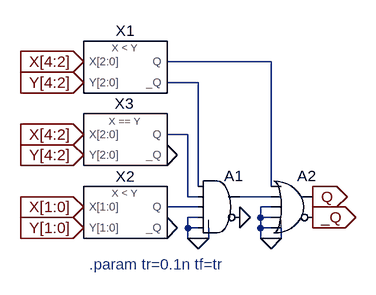
[diagram p0: schematic lt-5bit.asc]
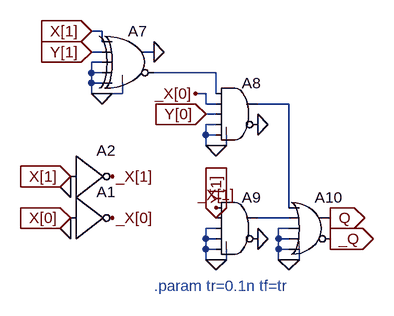
[diagram p1: sub-circuit lt-2bit.asc]
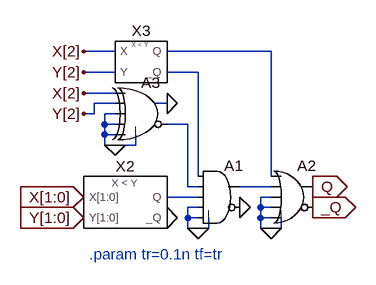
[diagram p2: sub-circuit lt-3bit.asc]
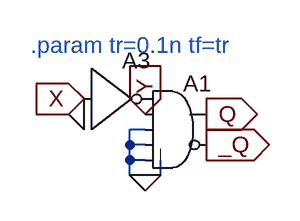
[diagram p3: sub-circuit lt.asc]
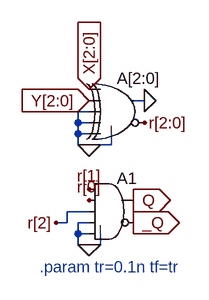
[diagram p4: sub-circuit eq-3bit.asc]
lt-5bit.asc, the LTspice schematic file:
Version 4
SHEET 1 880 680
WIRE 304 64 144 64
WIRE 192 96 144 96
WIRE 176 176 144 176
WIRE 192 256 192 96
WIRE 304 256 304 64
WIRE 176 272 176 176
WIRE 192 272 176 272
WIRE 304 272 256 272
WIRE 192 288 144 288
WIRE 304 288 288 288
WIRE 192 304 176 304
WIRE 288 304 288 288
WIRE 304 304 288 304
WIRE 176 320 176 304
WIRE 192 320 176 320
WIRE 288 320 288 304
WIRE 304 320 288 320
WIRE 176 336 176 320
WIRE 192 336 176 336
WIRE 208 336 208 320
WIRE 208 336 192 336
WIRE 288 336 288 320
WIRE 304 336 288 336
WIRE 320 336 320 320
WIRE 320 336 304 336
FLAG 16 64 X[4:2]
IOPIN 16 64 In
FLAG 16 288 X[1:0]
IOPIN 16 288 In
FLAG 16 176 X[4:2]
IOPIN 16 176 In
FLAG 16 96 Y[4:2]
IOPIN 16 96 In
FLAG 16 208 Y[4:2]
IOPIN 16 208 In
FLAG 16 320 Y[1:0]
IOPIN 16 320 In
FLAG 192 336 0
FLAG 256 304 0
FLAG 304 336 0
FLAG 368 272 Q
IOPIN 368 272 Out
FLAG 368 304 _Q
IOPIN 368 304 Out
FLAG 144 320 0
FLAG 144 208 0
SYMBOL lt-2bit 80 304 R0
SYMATTR InstName X2
SYMBOL Digital\\and 224 224 R0
SYMATTR InstName A1
SYMBOL Digital\\or 336 224 R0
SYMATTR InstName A2
SYMBOL lt-3bit 80 80 R0
SYMATTR InstName X1
SYMBOL eq-3bit 96 192 R0
SYMATTR InstName X3
TEXT 24 376 Left 2 ;.param tr=0.1n tf=tr

lt-2bit.asc, the sub-circuit schematic file:
Version 4
SHEET 1 880 680
WIRE 336 208 320 208
WIRE 336 224 336 208
WIRE 336 240 320 240
WIRE 416 240 400 240
WIRE 336 256 320 256
WIRE 320 272 320 256
WIRE 336 272 320 272
WIRE 512 272 416 272
WIRE 320 288 320 272
WIRE 336 288 320 288
WIRE 320 304 320 288
WIRE 336 304 320 304
WIRE 368 304 368 288
WIRE 368 304 336 304
WIRE 496 304 480 304
WIRE 512 304 512 272
WIRE 496 320 496 304
WIRE 512 320 496 320
WIRE 624 320 576 320
WIRE 512 336 496 336
WIRE 512 352 496 352
WIRE 496 368 496 352
WIRE 512 368 496 368
WIRE 496 384 496 368
WIRE 512 384 496 384
WIRE 528 384 528 368
WIRE 528 384 512 384
WIRE 624 480 624 320
WIRE 624 496 576 496
WIRE 512 512 496 512
WIRE 624 512 608 512
WIRE 496 528 496 512
WIRE 512 528 496 528
WIRE 608 528 608 512
WIRE 624 528 608 528
WIRE 496 544 496 528
WIRE 512 544 496 544
WIRE 608 544 608 528
WIRE 624 544 608 544
WIRE 496 560 496 544
WIRE 512 560 496 560
WIRE 528 560 528 544
WIRE 528 560 512 560
WIRE 608 560 608 544
WIRE 624 560 608 560
WIRE 640 560 640 544
WIRE 640 560 624 560
FLAG 288 448 0
FLAG 288 432 X[1]
IOPIN 288 432 In
FLAG 352 432 _X[1]
FLAG 480 304 _X[0]
FLAG 496 336 Y[0]
IOPIN 496 336 In
FLAG 288 512 0
FLAG 288 496 X[0]
IOPIN 288 496 In
FLAG 352 496 _X[0]
FLAG 320 240 Y[1]
IOPIN 320 240 In
FLAG 320 208 X[1]
IOPIN 320 208 In
FLAG 336 304 0
FLAG 512 384 0
FLAG 576 352 0
FLAG 416 240 0
FLAG 512 560 0
FLAG 576 528 0
FLAG 512 496 Y[1]
IOPIN 512 496 In
FLAG 512 480 _X[1]
FLAG 624 560 0
FLAG 688 496 Q
IOPIN 688 496 Out
FLAG 688 528 _Q
IOPIN 688 528 Out
SYMBOL Digital\\inv 288 368 R0
SYMATTR InstName A2
SYMBOL Digital\\and 544 272 R0
SYMATTR InstName A8
SYMBOL Digital\\and 544 448 R0
SYMATTR InstName A9
SYMBOL Digital\\or 656 448 R0
SYMATTR InstName A10
SYMBOL Digital\\xor 384 192 R0
SYMATTR InstName A7
SYMBOL Digital\\inv 288 432 R0
SYMATTR InstName A1
TEXT 416 600 Left 2 ;.param tr=0.1n tf=tr

lt-3bit.asc, the sub-circuit schematic file:
Version 4
SHEET 1 880 680
WIRE 64 64 16 64
WIRE 304 64 144 64
WIRE 64 96 16 96
WIRE 192 96 144 96
WIRE 64 128 16 128
WIRE 64 144 32 144
WIRE 144 144 128 144
WIRE 32 160 32 144
WIRE 32 160 16 160
WIRE 64 160 48 160
WIRE 48 176 48 160
WIRE 64 176 48 176
WIRE 176 176 144 176
WIRE 48 192 48 176
WIRE 64 192 48 192
WIRE 48 208 48 192
WIRE 64 208 48 208
WIRE 96 208 96 192
WIRE 96 208 64 208
WIRE 192 256 192 96
WIRE 304 256 304 64
WIRE 176 272 176 176
WIRE 192 272 176 272
WIRE 304 272 256 272
WIRE 192 288 144 288
WIRE 304 288 288 288
WIRE 192 304 176 304
WIRE 288 304 288 288
WIRE 304 304 288 304
WIRE 176 320 176 304
WIRE 192 320 176 320
WIRE 288 320 288 304
WIRE 304 320 288 320
WIRE 176 336 176 320
WIRE 192 336 176 336
WIRE 208 336 208 320
WIRE 208 336 192 336
WIRE 288 336 288 320
WIRE 304 336 288 336
WIRE 320 336 320 320
WIRE 320 336 304 336
FLAG 16 288 X[1:0]
IOPIN 16 288 In
FLAG 16 320 Y[1:0]
IOPIN 16 320 In
FLAG 192 336 0
FLAG 256 304 0
FLAG 304 336 0
FLAG 368 272 Q
IOPIN 368 272 Out
FLAG 368 304 _Q
IOPIN 368 304 Out
FLAG 144 320 0
FLAG 144 144 0
FLAG 16 64 X[2]
FLAG 16 128 X[2]
FLAG 16 96 Y[2]
FLAG 16 160 Y[2]
FLAG 64 208 0
SYMBOL lt-2bit 80 304 R0
SYMATTR InstName X2
SYMBOL Digital\\and 224 224 R0
SYMATTR InstName A1
SYMBOL Digital\\or 336 224 R0
SYMATTR InstName A2
SYMBOL lt 96 80 R0
SYMATTR InstName X3
SYMBOL Digital\\xor 112 96 R0
SYMATTR InstName A3
TEXT 24 376 Left 2 ;.param tr=0.1n tf=tr

lt.asc, the sub-circuit schematic file:
Version 4
SHEET 1 880 680
WIRE 128 128 112 128
WIRE 112 144 112 128
WIRE 128 144 112 144
WIRE 112 160 112 144
WIRE 128 160 112 160
WIRE 112 176 112 160
WIRE 128 176 112 176
WIRE 144 176 144 160
WIRE 144 176 128 176
FLAG 128 176 0
FLAG 64 112 0
FLAG 192 112 Q
IOPIN 192 112 Out
FLAG 192 144 _Q
IOPIN 192 144 Out
FLAG 64 96 X
IOPIN 64 96 In
FLAG 128 112 Y
IOPIN 128 112 In
SYMBOL Digital\\and 160 64 R0
SYMATTR InstName A1
SYMBOL Digital\\inv 64 32 R0
SYMATTR InstName A3
TEXT 8 40 Left 2 ;.param tr=0.1n tf=tr

eq-3bit.asc, the sub-circuit schematic file:
Version 4
SHEET 1 880 680
WIRE 176 112 160 112
WIRE 96 128 80 128
WIRE 80 144 80 128
WIRE 96 144 80 144
WIRE 80 160 80 144
WIRE 96 160 80 160
WIRE 80 176 80 160
WIRE 96 176 80 176
WIRE 128 176 128 160
WIRE 128 176 96 176
WIRE 96 272 64 272
WIRE 64 288 64 272
WIRE 64 288 48 288
WIRE 96 288 80 288
WIRE 80 304 80 288
WIRE 96 304 80 304
WIRE 80 320 80 304
WIRE 96 320 80 320
WIRE 112 320 112 304
WIRE 112 320 96 320
FLAG 96 176 0
FLAG 96 96 X[2:0]
IOPIN 96 96 In
FLAG 96 112 Y[2:0]
IOPIN 96 112 In
FLAG 176 112 0
FLAG 176 144 r[2:0]
FLAG 96 320 0
FLAG 96 240 r[1]
FLAG 96 256 r[0]
FLAG 160 256 Q
IOPIN 160 256 Out
FLAG 160 288 _Q
IOPIN 160 288 Out
FLAG 48 288 r[2]
SYMBOL Digital\\xor 144 64 R0
SYMATTR InstName A[2:0]
SYMBOL Digital\\and 128 208 R0
SYMATTR InstName A1
TEXT 24 352 Left 2 ;.param tr=0.1n tf=tr

The netlist it stands for:
* lt-5bit.asc
XX2 X[1] X[0] Y[1] Y[0] 0 N005 lt-2bit
A1 N002 N003 N005 0 0 0 N004 0 AND
A2 N001 N004 0 0 0 _Q Q 0 OR
XX1 X[4] X[3] X[2] Y[4] Y[3] Y[2] N002 N001 lt-3bit
XX3 X[4] X[3] X[2] Y[4] Y[3] Y[2] 0 N003 eq-3bit

* block symbol definitions
.subckt lt-2bit X[1] X[0] Y[1] Y[0] _Q Q
A2 X[1] 0 0 0 0 _X[1] 0 0 BUF
A8 N001 _X[0] Y[0] 0 0 0 N002 0 AND
A9 _X[1] Y[1] 0 0 0 0 N003 0 AND
A10 N002 N003 0 0 0 _Q Q 0 OR
A7 X[1] Y[1] 0 0 0 N001 0 0 XOR
A1 X[0] 0 0 0 0 _X[0] 0 0 BUF
* .param tr=0.1n tf=tr
.ends lt-2bit

.subckt lt-3bit X[2] X[1] X[0] Y[2] Y[1] Y[0] _Q Q
XX2 X[1] X[0] Y[1] Y[0] 0 N005 lt-2bit
A1 N002 N003 N005 0 0 0 N004 0 AND
A2 N001 N004 0 0 0 _Q Q 0 OR
XX3 X[2] Y[2] N002 N001 lt
A3 X[2] Y[2] 0 0 0 N003 0 0 XOR
* .param tr=0.1n tf=tr
.ends lt-3bit

.subckt lt X Y _Q Q
A1 P001 Y 0 0 0 _Q Q 0 AND
A3 X 0 0 0 0 P001 0 0 BUF
* .param tr=0.1n tf=tr
.ends lt

.subckt eq-3bit X[2] X[1] X[0] Y[2] Y[1] Y[0] _Q Q
A[2:0] X[2:0] Y[2:0] 0 0 0 r[2:0] 0 0 XOR
A1 r[1] r[0] r[2] 0 0 _Q Q 0 AND
* .param tr=0.1n tf=tr
.ends eq-3bit

* .param tr=0.1n tf=tr
.backanno
.end